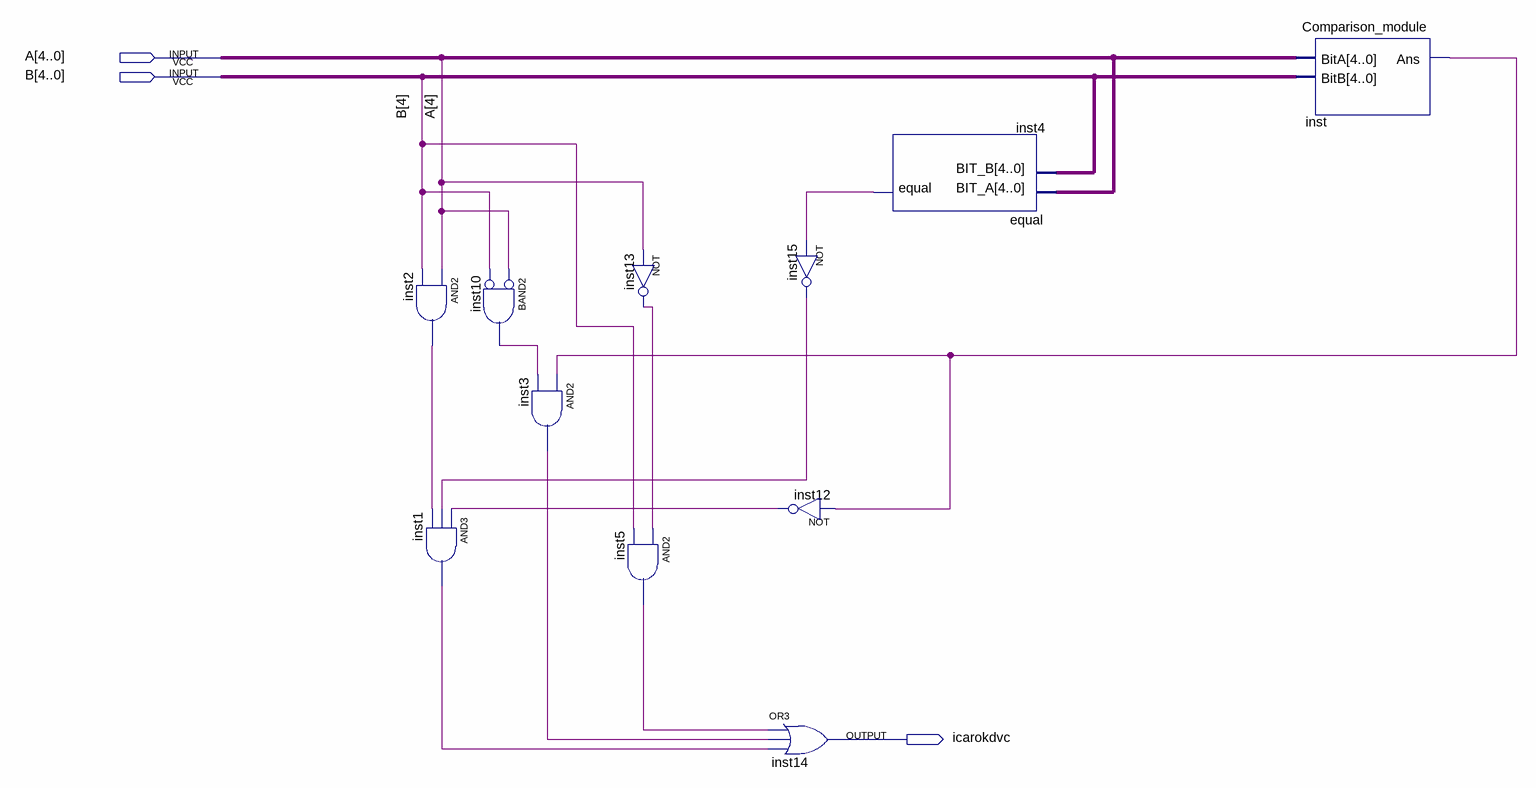
[diagram p0: schematic sheet]
// Quartus schematic cmp_more_than.bdf as structural Verilog: 11 symbols, 3 pins
module cmp_more_than (
  input  [4:0] A,
  input  [4:0] B,
  output icarokdvc
);

  wire inst1_out, inst2_out, inst3_out, inst4_equal, inst5_out, inst10_out, inst12_out, inst13_out,
       inst15_out, inst_ans;

  and inst2 (inst2_out, A[4], B[4]);
  and inst1 (inst1_out, inst12_out, inst15_out, inst2_out);
  and inst10 (inst10_out, ~A[4], ~B[4]);  // BAND2
  and inst3 (inst3_out, inst_ans, inst10_out);
  not inst13 (inst13_out, A[4]);
  and inst5 (inst5_out, inst13_out, B[4]);
  not inst15 (inst15_out, inst4_equal);
  not inst12 (inst12_out, inst_ans);
  or inst14 (icarokdvc, inst5_out, inst3_out, inst1_out);
  equal inst4 (.BIT_A(A), .BIT_B(B), .equal(inst4_equal));
  Comparison_module inst (.BitA(A), .BitB(B), .Ans(inst_ans));
endmodule
